# Altium schematic sheet 01-Revision_History_and_Contents.SchDoc: Revision History and Contents
size A; Date: 4/25/2017; ApprovedBy: JSK; CheckedBy: JSK; Author: JSK; CompanyName: University of Wisconsin; DrawnBy: JSK; Engineer: JSK; Organization: ECE 315; Address1: College of Engineering; Address2: 1415 Engineering Drive; Address3: Madison, WI 53706; Address4: ECE 453 Spring 2017; Revision: A; SheetNumber: 1; SheetTotal: 2
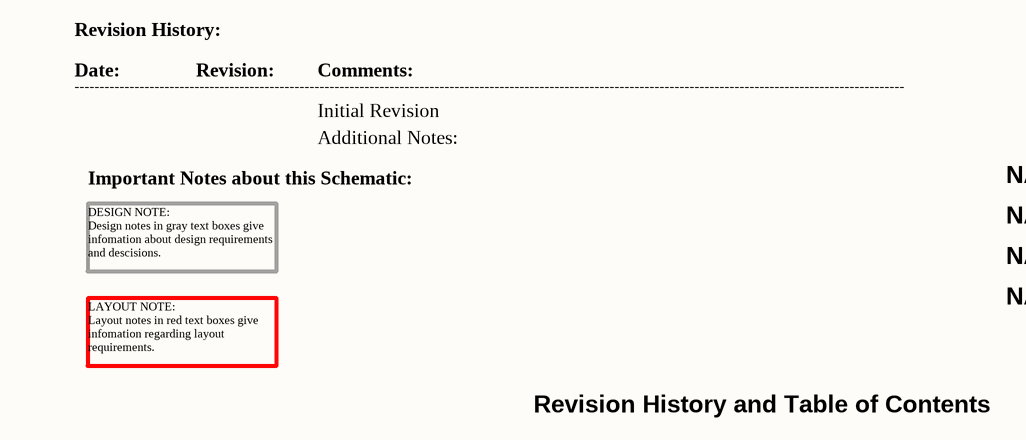
[diagram p0: 01-Revision_History_and_Contents.SchDoc]

## Notes on the sheet
- Revision History:
- Date:
- ----------------------------------------------------------------------------------------------------------------------------------------------------------------------
- Revision:
- Comments:
- Initial Revision
- Important Notes about this Schematic:
- Additional Notes:
- NAME: <TEAMMATE 1>
- NAME: <TEAMMATE 2>
- DESIGN NOTE:
  Design notes in gray text boxes give infomation about design requirements and descisions.
- NAME: <TEAMMATE 3>
- NAME: <TEAMMATE 4>
- LAYOUT NOTE:
  Layout notes in red text boxes give infomation regarding layout requirements.
- Revision History and Table of Contents